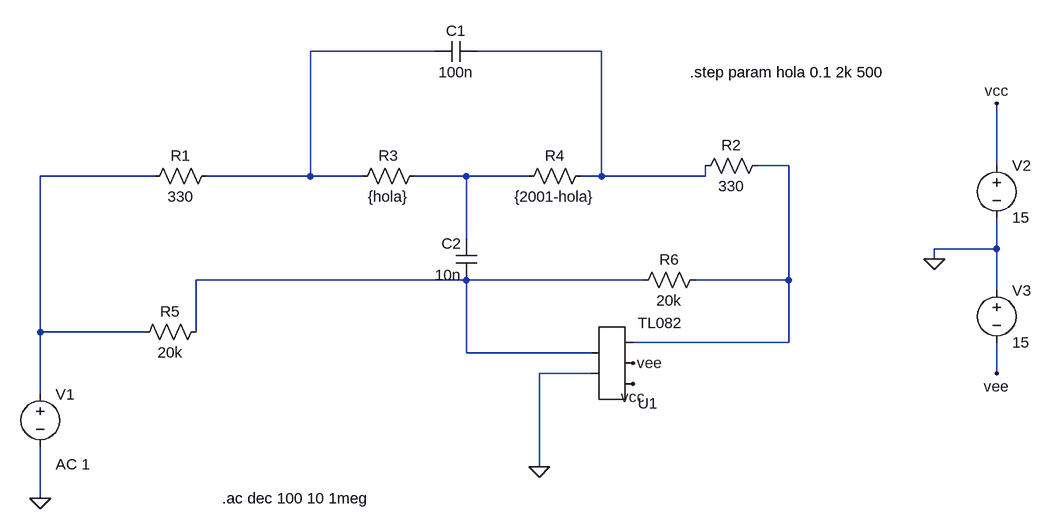
[diagram p0: schematic Spice.asc]
Spice.asc, the LTspice schematic file:
Version 4
SHEET 1 952 680
WIRE 32 -304 -160 -304
WIRE 288 -304 96 -304
WIRE 576 -128 528 -128
WIRE 896 -128 896 -224
WIRE -400 -112 -576 -112
WIRE -160 -112 -160 -304
WIRE -160 -112 -320 -112
WIRE -80 -112 -160 -112
WIRE 80 -112 0 -112
WIRE 176 -112 80 -112
WIRE 288 -112 288 -304
WIRE 288 -112 256 -112
WIRE 448 -112 448 -128
WIRE 448 -112 288 -112
WIRE 80 -16 80 -112
WIRE 896 0 896 -48
WIRE 896 0 800 0
WIRE 800 16 800 0
WIRE 80 48 -336 48
WIRE 352 48 80 48
WIRE 576 48 576 -128
WIRE 576 48 432 48
WIRE 896 64 896 0
WIRE -576 128 -576 -112
WIRE -416 128 -576 128
WIRE -336 128 -336 48
WIRE 576 144 576 48
WIRE 576 144 336 144
WIRE 80 160 80 48
WIRE 272 160 80 160
WIRE 272 192 192 192
WIRE 896 192 896 144
WIRE -576 224 -576 128
WIRE 192 336 192 192
WIRE -576 384 -576 304
FLAG 192 336 0
FLAG -576 384 0
FLAG 800 16 0
FLAG 896 -224 vcc
FLAG 896 192 vee
FLAG 336 208 vcc
FLAG 336 176 vee
SYMBOL res -304 -128 R90
WINDOW 0 0 56 VBottom 2
WINDOW 3 32 56 VTop 2
SYMATTR InstName R1
SYMATTR Value 330
SYMBOL res 544 -144 R90
WINDOW 0 0 56 VBottom 2
WINDOW 3 32 56 VTop 2
SYMATTR InstName R2
SYMATTR Value 330
SYMBOL res 16 -128 R90
WINDOW 0 0 56 VBottom 2
WINDOW 3 32 56 VTop 2
SYMATTR InstName R3
SYMATTR Value {hola}
SYMBOL res 272 -128 R90
WINDOW 0 0 56 VBottom 2
WINDOW 3 32 56 VTop 2
SYMATTR InstName R4
SYMATTR Value {2001-hola}
SYMBOL res -320 112 R90
WINDOW 0 0 56 VBottom 2
WINDOW 3 32 56 VTop 2
SYMATTR InstName R5
SYMATTR Value 20k
SYMBOL res 448 32 R90
WINDOW 0 0 56 VBottom 2
WINDOW 3 32 56 VTop 2
SYMATTR InstName R6
SYMATTR Value 20k
SYMBOL cap 96 -320 R90
WINDOW 0 0 32 VBottom 2
WINDOW 3 32 32 VTop 2
SYMATTR InstName C1
SYMATTR Value 100n
SYMBOL cap 96 48 R180
WINDOW 0 24 56 Left 2
WINDOW 3 24 8 Left 2
SYMATTR InstName C2
SYMATTR Value 10n
SYMBOL voltage -576 208 R0
WINDOW 123 24 124 Left 2
WINDOW 39 0 0 Left 2
SYMATTR Value2 AC 1
SYMATTR InstName V1
SYMATTR Value ""
SYMBOL voltage 896 -144 R0
WINDOW 123 0 0 Left 2
WINDOW 39 0 0 Left 2
SYMATTR InstName V2
SYMATTR Value 15
SYMBOL voltage 896 48 R0
WINDOW 123 0 0 Left 2
WINDOW 39 0 0 Left 2
SYMATTR InstName V3
SYMATTR Value 15
SYMBOL AutoGenerated\\TL082 304 176 M180
SYMATTR InstName U1
TEXT -296 384 Left 2 !.ac dec 100 10 1meg
TEXT 424 -272 Left 2 !.step param hola 0.1 2k 500

The netlist it stands for:
* Spice.asc
R1 N001 N004 330
R2 N003 N002 330
R3 N005 N001 {hola}
R4 N002 N005 {2001-hola}
R5 N006 N004 20k
R6 N003 N006 20k
C1 N002 N001 100n
C2 N006 N005 10n
V1 N004 0 AC 1
V2 vcc 0 15
V3 0 vee 15
* U1: TL082 (symbol AutoGenerated\TL082 not available, pins judged from their places): pin1=0 pin2=N006 pin3=vcc pin4=vee pin5=N003
.ac dec 100 10 1meg
.step param hola 0.1 2k 500
.backanno
.end